# EAGLE schematic Hub (EAGLE 6.1)
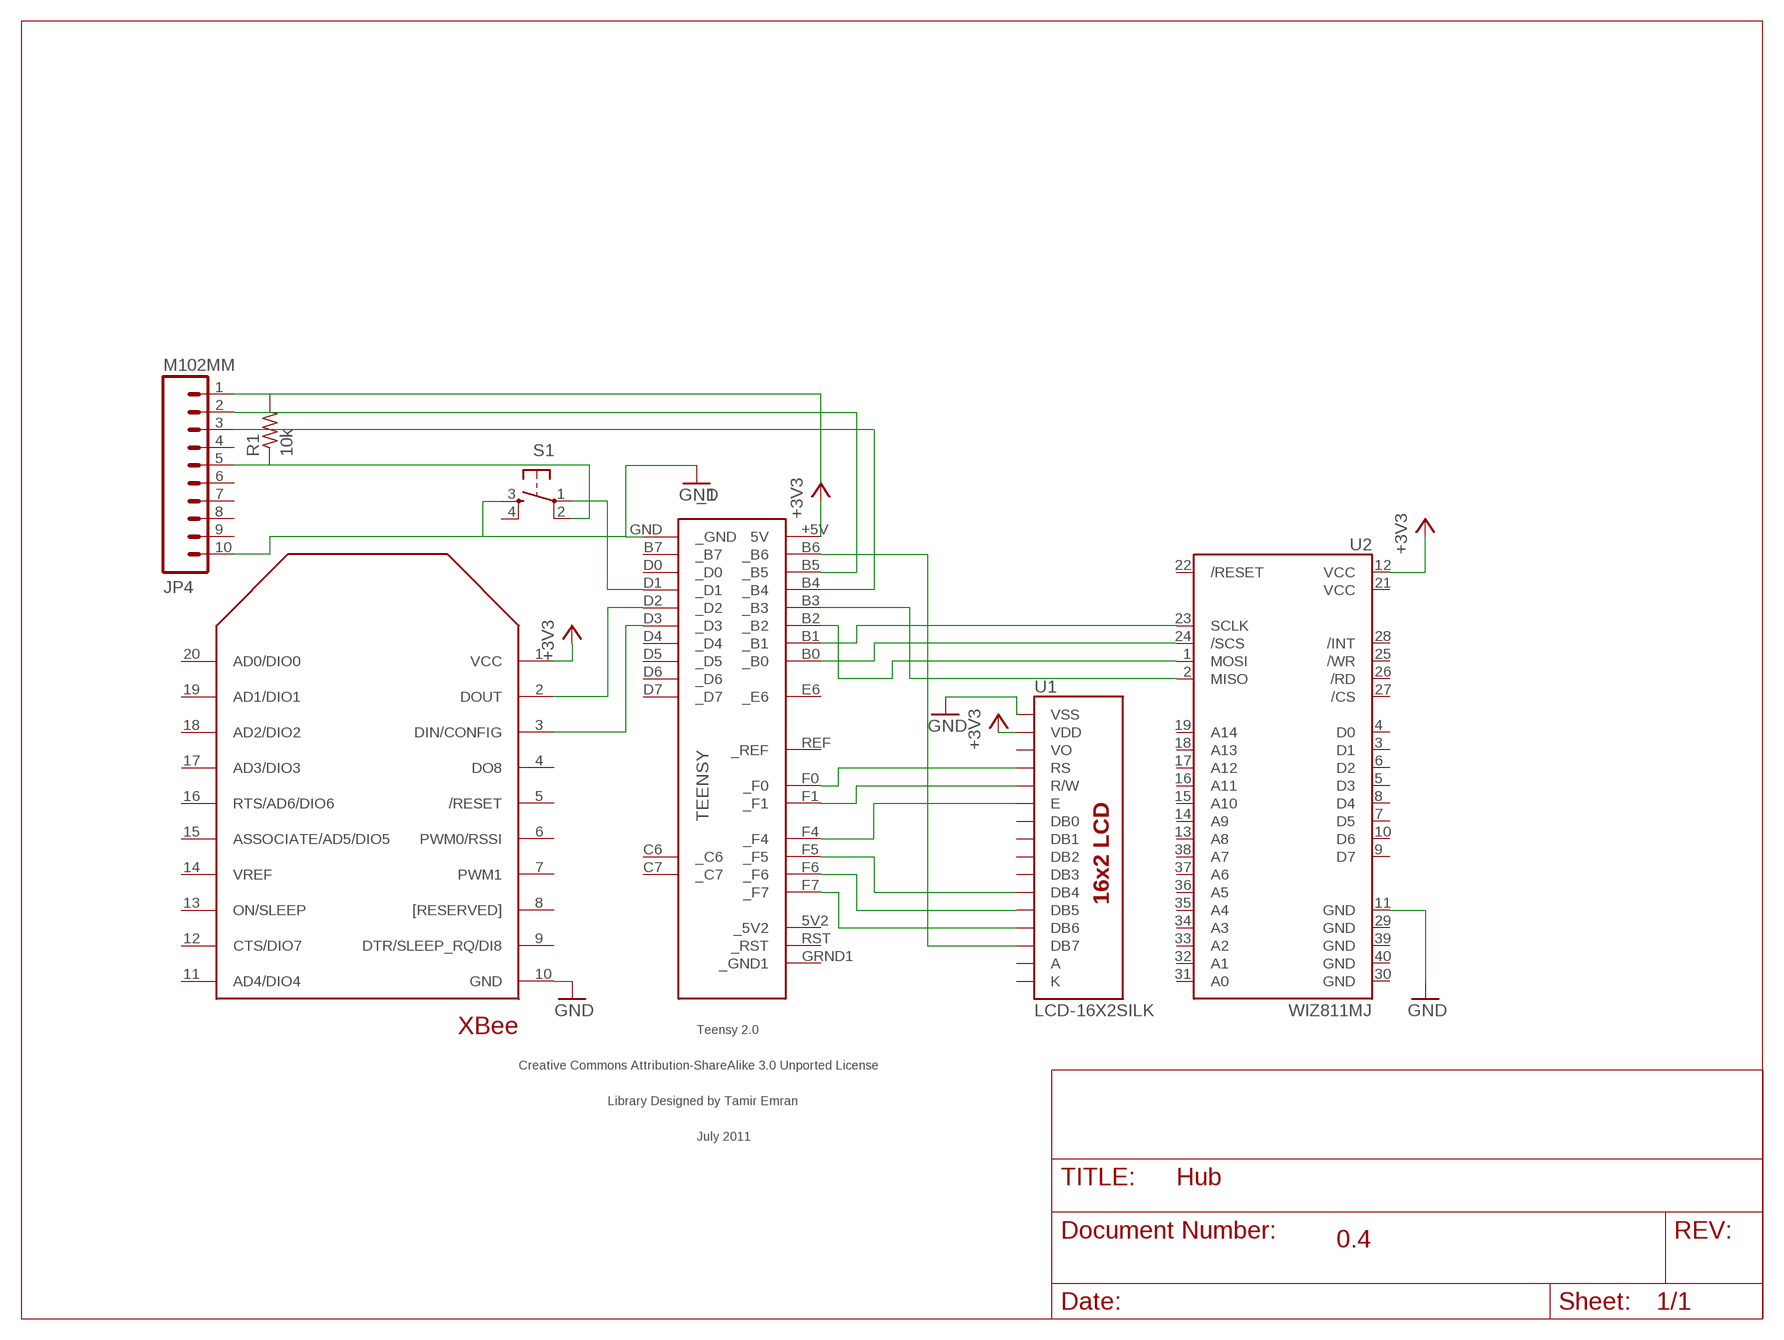
[diagram p0: schematic, sheet 1]

## Parts
_1  TEENSY  [TEENSY]
JP4  M102MM  [1X10-2MM]
R1  10k  R-US_0207/7  [0207/7]
S1  TAC_SWITCHPTH  [TACTILE-PTH]
U1  LCD-16X2SILK  [LCD-16X2]
U2  WIZ811MJ  [WIZ811MJ]
U$1  XBEE  [XBEE]

## Nets
+3V3: _1.+5V(5V) U1.2(VDD) U2.12(VCC) U$1.1(VCC)
GND: _1.GND(_GND) JP4.10 S1.3 U1.1(VSS) U2.11(GND) U$1.10(GND)
N$1: _1.F7(_F7) U1.13(DB6)
N$2: _1.F6(_F6) U1.12(DB5)
N$3: _1.F5(_F5) U1.11(DB4)
N$4: _1.F4(_F4) U1.6(E)
N$5: _1.F0(_F0) U1.4(RS)
N$6: _1.F1(_F1) U1.5(R/W)
N$7: _1.B6(_B6) U1.14(DB7)
N$8: _1.B1(_B1) U2.23(SCLK)
N$9: _1.B0(_B0) U2.24(/SCS)
N$10: _1.B2(_B2) U2.1(MOSI)
N$11: _1.B3(_B3) U2.2(MISO)
N$12: _1.D3(_D3) U$1.3(DIN/CONFIG)
N$13: JP4.1 R1.2
N$14: _1.B5(_B5) JP4.2
N$15: _1.B4(_B4) JP4.3
N$17: _1.D2(_D2) U$1.2(DOUT)
N$23: JP4.5 R1.1 S1.2
N$25: _1.D1(_D1) S1.1
Unconnected: _1.5V2(_5V2) _1.B7(_B7) _1.C6(_C6) _1.C7(_C7) _1.D0(_D0) _1.D4(_D4) _1.D5(_D5) _1.D6(_D6) _1.D7(_D7) _1.E6(_E6) _1.GRND1(_GND1) _1.REF(_REF) _1.RST(_RST) JP4.4 JP4.6 JP4.7 JP4.8 JP4.9 S1.4 U1.3(VO) U1.7(DB0) U1.8(DB1) U1.9(DB2) U1.10(DB3) U2.3(D1) U2.4(D0) U2.5(D3) U2.6(D2) U2.7(D5) U2.8(D4) U2.9(D7) U2.10(D6) U2.13(A8) U2.14(A9) U2.15(A10) U2.16(A11) U2.17(A12) U2.18(A13) U2.19(A14) U2.21(VCC) U2.22(/RESET) U2.25(/WR) U2.26(/RD) U2.27(/CS) U2.28(/INT) U2.29(GND) U2.30(GND) U2.31(A0) U2.32(A1) U2.33(A2) U2.34(A3) U2.35(A4) U2.36(A5) U2.37(A6) U2.38(A7) U2.39(GND) U2.40(GND) U$1.4(DO8) U$1.5(/RESET) U$1.6(PWM0/RSSI) U$1.7(PWM1) U$1.8([RESERVED]) U$1.9(DTR/SLEEP_RQ/DI8) U$1.11(AD4/DIO4) U$1.12(CTS/DIO7) U$1.13(ON/SLEEP) U$1.14(VREF) U$1.15(ASSOCIATE/AD5/DIO5) U$1.16(RTS/AD6/DIO6) U$1.17(AD3/DIO3) U$1.18(AD2/DIO2) U$1.19(AD1/DIO1) U$1.20(AD0/DIO0)

## Notes on the sheet
- 0.4

## Power pins joined to a net without a drawn wire
A: U1.15(A)
K: U1.16(K)

## Library data of the parts
_1 = teensy:TEENSY: Teensy 2.0 Original Design by Clint Fisher Modified Design by Tamir Emran Licensed Under Creative Commons Attribution-ShareAlike 3.0 Unported (CC BY-SA 3.0)
JP4 = SparkFun-Connectors:M10: Header 10 Standard 10-pin 0.1" header. Use with straight break away headers (SKU : PRT-00116), right angle break away headers (PRT-00553), swiss pins (PRT-00743), machine pins (PRT-00117), and female headers (PRT-00115).
R1 = resistor:R-US_: RESISTOR, American symbol
S1 = SparkFun-Electromechanical:TAC_SWITCH: Momentary Switch Button commonly used for reset or general input. Spark Fun Electronics SKU : COM-00097 SMT- SWCH-08247
U1 = SparkFun-Displays:LCD-16X2: Standard text-only 16x2 parallel input LCD
U2 = SparkFun-Boards:WIZ811MJ: WIZnet W5100 Network Module with MagJack - WIZ811MJ WIZnet's WIZ811MJ is a breakout board for the W5100 embedded TCP/IP chip. Also included on the board is a RJ-45 MagJack Connector (RJ45 with X'FMR). See http://www.sparkfun.com/commerce/product_info.php?products_id=9473 for more documentation and info. **UNPROVEN
U$1 = CEDT:XBEE